# EasyEDA schematic schematic.easyeda.json
TITLE: SuperSensor; REV: 3.0; Date: 2025-11-12; Sheet: 1/1; Drawn By: Joshua M. Boniface; Company: Boniface Labs
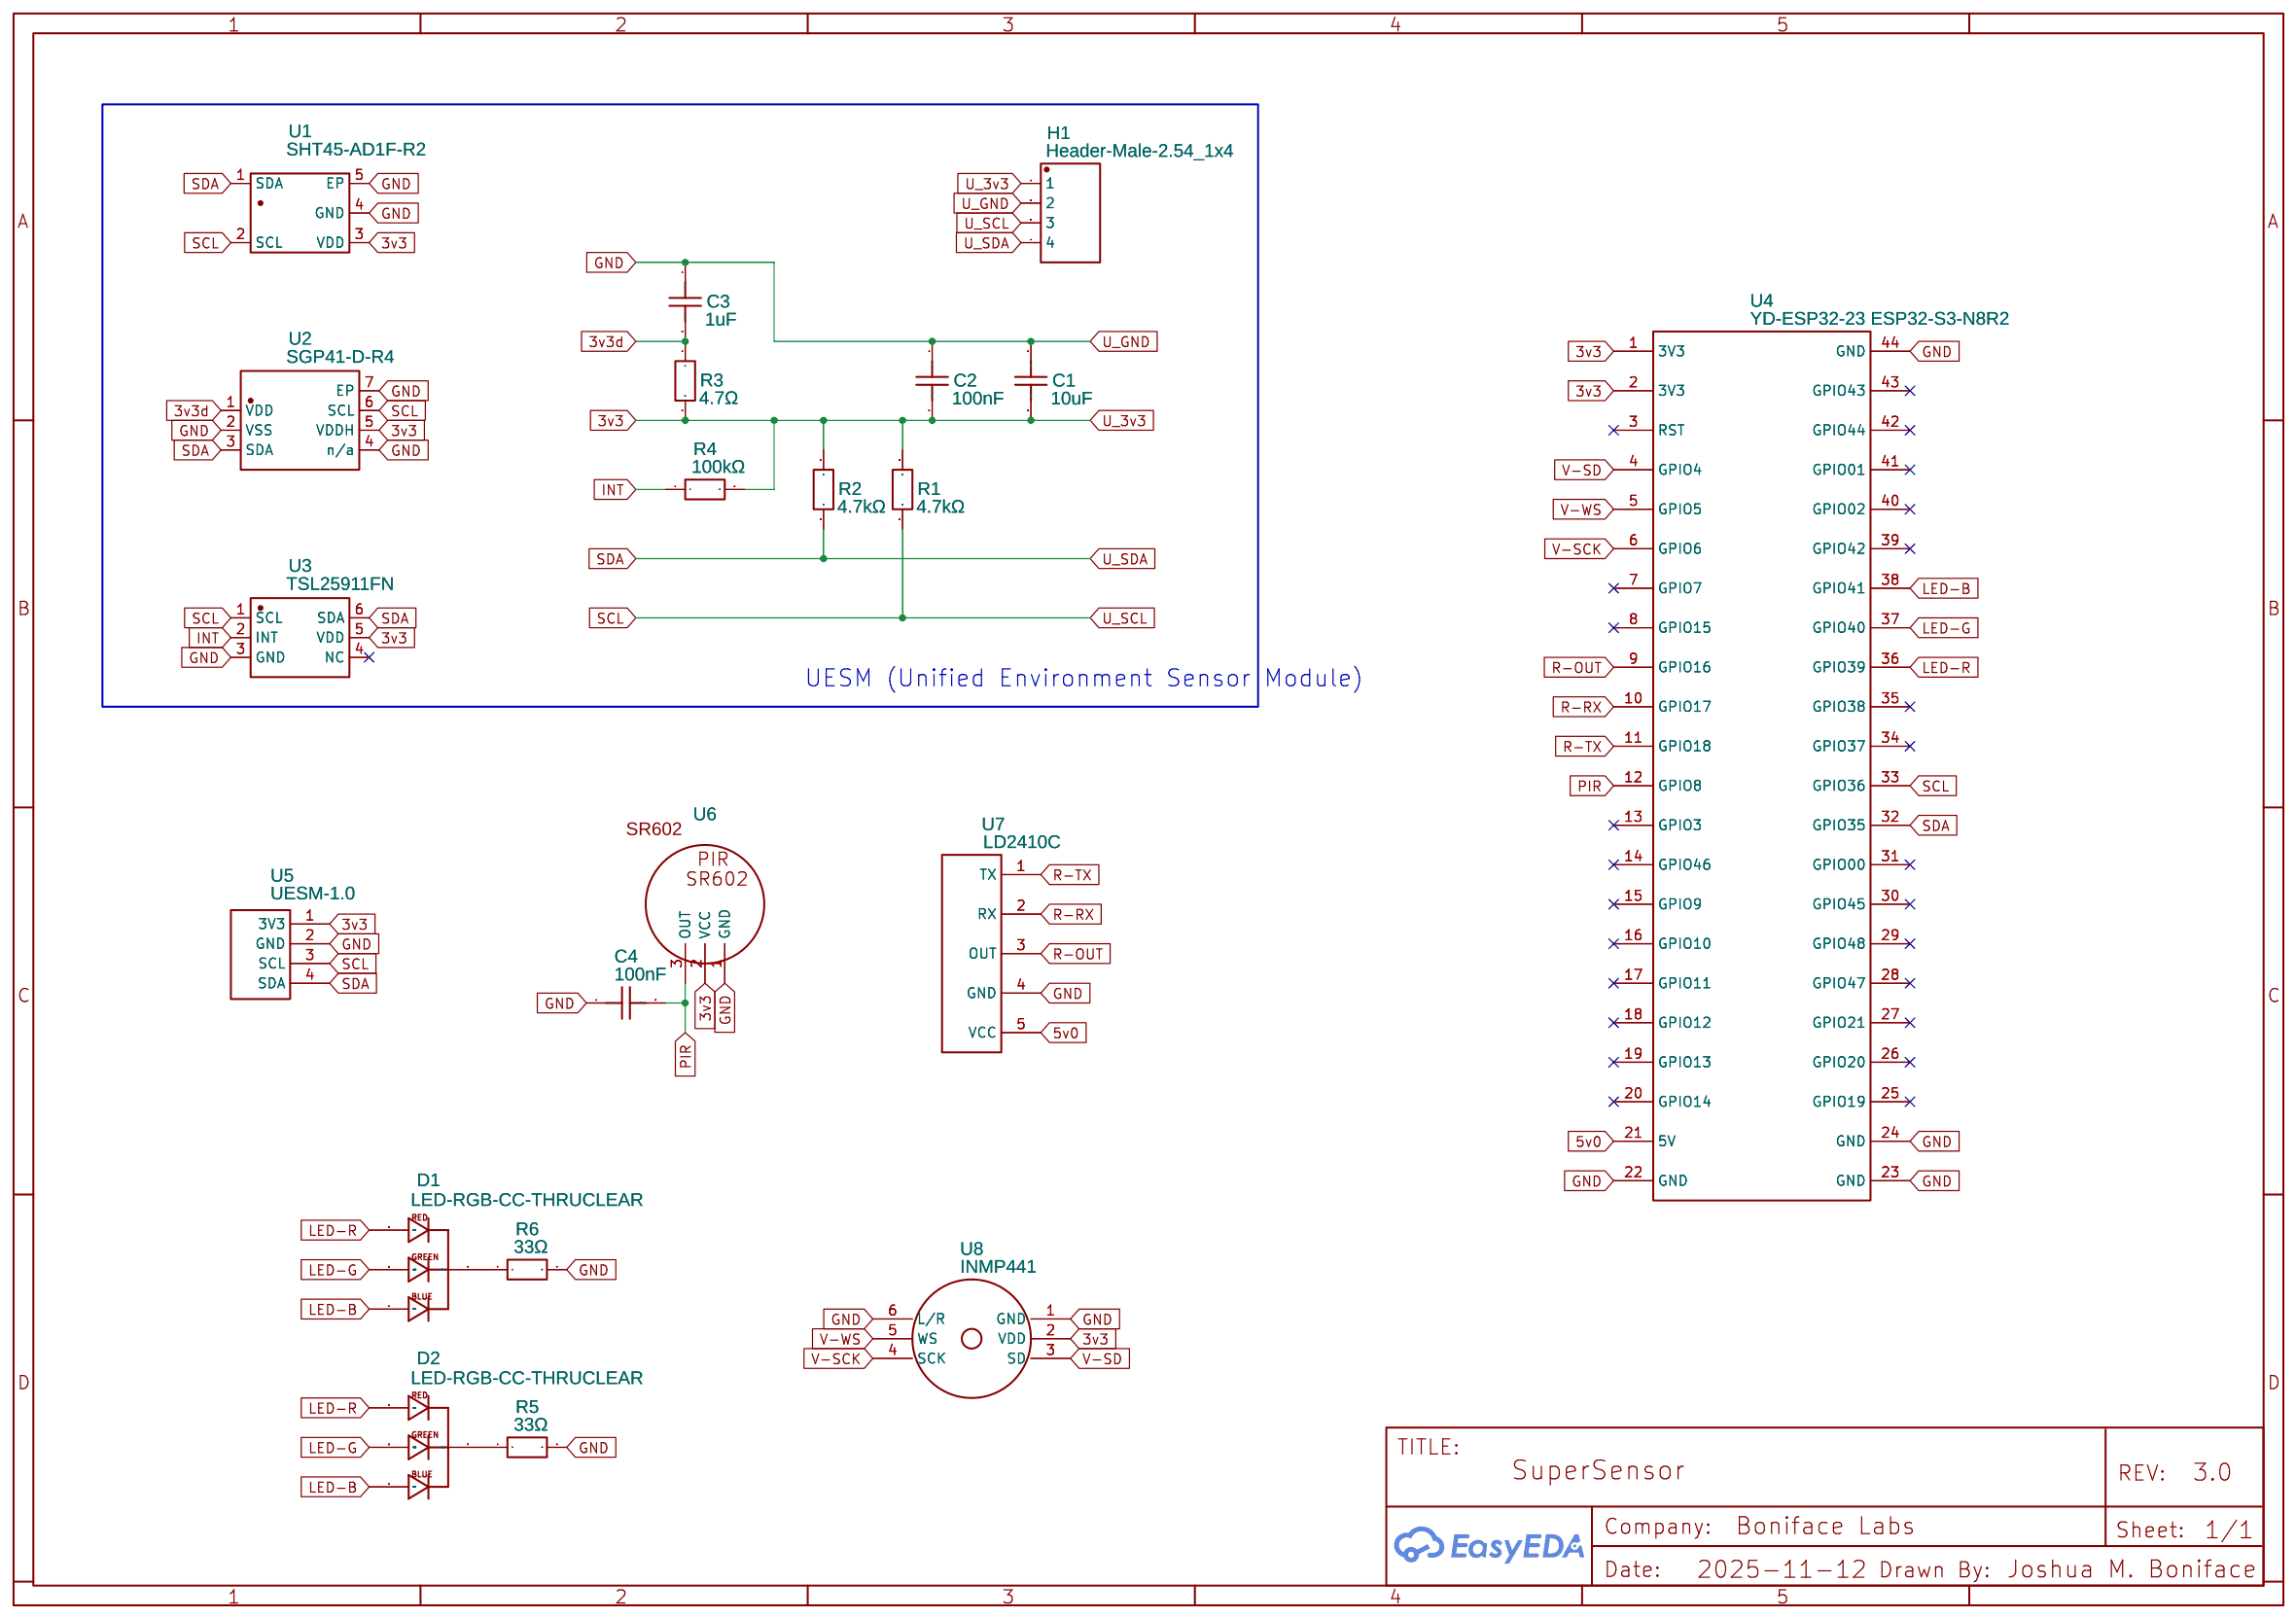
[diagram p0: schematic sheet]

## Parts
C1  10uF  [C0805]
C2  100nF  [C0805]
C3  1uF  [C0805]
C4  100nF  [C0805]
D1  LED-RGB-CC-THRUCLEAR  [LED-RGB-THRU]
D2  LED-RGB-CC-THRUCLEAR  [LED-RGB-THRU]
H1  Header-Male-2.54_1x4  [HDR-TH_4P-P2.54-V-M]
R1  4.7kΩ  [R1206]
R2  4.7kΩ  [R1206]
R3  4.7Ω  [R1206]
R4  100kΩ  [R0603]
R5  33Ω  [R1206]
R6  33Ω  [R1206]
U1  SHT45-AD1F-R2  [DFN-4_L1.5-W1.5-P0.8-TL-EP]
U2  SGP41-D-R4  [DFN-6_L2.4-W2.4-P0.80-TL-EP]
U3  TSL25911FN  [DFN-6_L2.4-W2.0-P0.65-BL]
U4  YD-ESP32-23 ESP32-S3-N8R2  [YD-ESP32-23 V1.3 ESP32-S3 REAL SIZE]
U5  UESM-1.0  [UESM-1.0]
U6  PIRSR602  [SR602_JB]
U7  LD2410C  [HLK-LD2410C_JB]
U8  INMP441  [INMP441-MEMS-I2S-MIC-MODULE_JB]

## Library data of the parts
C1 = C2012JB1C106K125AB: Contributor: lcsc; Supplier: LCSC; Supplier Part: C3905660; Manufacturer: TDK; JLCPCB Part Class: Extended Part
C2 C4 = C2012JB2A104K125AA: Contributor: lcsc; Supplier: LCSC; Supplier Part: C3875091; Manufacturer: TDK; JLCPCB Part Class: Extended Part
C3 = C2012X5R1E105K085AC: Contributor: lcsc; Supplier: LCSC; Supplier Part: C3905748; Manufacturer: TDK; JLCPCB Part Class: Extended Part
D1 D2 = LED-RGB-CC-THRUCLEAR: RGB Through-hole common cathode LED; Contributor: SparkFun
H1 = Header-Male-2.54_1x4: Contributor: LCSC; Supplier: LCSC; Manufacturer: Ckmtw(灿科盟); Manufacturer Part: B-2100S04P-A110; Supplier Part: C124378; JLCPCB Part Class: Extended Part
R1-R3 R5 R6 = CRGP1206F4K7: Supplier: LCSC; Supplier Part: C2074453; Manufacturer: TE Connectivity(泰科电子); JLCPCB Part Class: Extended Part; Contributor: lcsc
R4 = WF06H1003BTL: Supplier: LCSC; Supplier Part: C6025378; Manufacturer: Walsin(华新科); JLCPCB Part Class: Extended Part; Contributor: lcsc
U1 = SHT45-AD1F-R2: Supplier: LCSC; Supplier Part: C5360602; Manufacturer: Sensirion(瑞士盛思锐); JLCPCB Part Class: Extended Part; Contributor: lcsc
U2 = SGP41-D-R4: Contributor: lcsc; Supplier: LCSC; Supplier Part: C3659325; Manufacturer: Sensirion(瑞士盛思锐); JLCPCB Part Class: Extended Part
U3 = TSL25911FN: Contributor: lcsc; Supplier: LCSC; Supplier Part: C176812; Manufacturer: ams(艾迈斯半导体); JLCPCB Part Class: Extended Part
U4 = YD-ESP32-23 ESP32-S3-N16R8 REALSIZE AHRS: Contributor: raskatheli
U5 = UESM-1.0: Supplier: AliExpress; Contributor: mengrie
U6 = PIRSR602: Contributor: Vishal Autade
U7 = HLK-LD2410C WITH PCB: Supplier: AliExpress; Contributor: rockclimber
U8 = INMP441-MEMS-I2S-MIC-MODULE: Supplier: ebay; link: https://www.ebay.de/itm/174127178542; Contributor: cun280

## Nets
3v3: C1.2 C2.2 H1.1 R1.1 R2.1 R3.2 R4.2 U1.3(VDD) U2.5(VDDH) U3.5(VDD) U4.1(3V3) U4.2(3V3) U5.1(3V3) U6.2(VCC) U8.2(VDD)
3v3d: C3.2 R3.1 U2.1(VDD)
5v0: U4.21(5V) U7.5(VCC)
GND: C1.1 C2.1 C3.1 C4.1 H1.2 R5.2 R6.2 U1.4(GND) U1.5(EP) U2.2(VSS) U2.4(n/a) U2.7(EP) U3.3(GND) U4.22(GND) U4.23(GND) U4.24(GND) U4.44(GND) U5.2(GND) U6.1(GND) U7.4(GND) U8.1(GND) U8.6(L/R)
INT: R4.1 U3.2(INT)
LED-B: D1.4(BLUE_CATHODE) D2.4(BLUE_CATHODE) U4.38(GPIO41)
LED-G: D1.3(GREEN_CATHODE) D2.3(GREEN_CATHODE) U4.37(GPIO40)
LED-R: D1.1(RED_CATHODE) D2.1(RED_CATHODE) U4.36(GPIO39)
PIR: C4.2 U4.12(GPIO8) U6.3(OUT)
R-OUT: U4.9(GPIO16) U7.3(OUT)
R-RX: U4.10(GPIO17) U7.2(RX)
R-TX: U4.11(GPIO18) U7.1(TX)
SCL: H1.3 R1.2 U1.2(SCL) U2.6(SCL) U3.1(SCL) U4.33(GPIO36) U5.3(SCL)
SDA: H1.4 R2.2 U1.1(SDA) U2.3(SDA) U3.6(SDA) U4.32(GPIO35) U5.4(SDA)
V-SCK: U4.6(GPIO6) U8.4(SCK)
V-SD: U4.4(GPIO4) U8.3(SD)
V-WS: U4.5(GPIO5) U8.5(WS)
Net-(D1-2): D1.2(CATHODE) R6.1
Net-(D2-2): D2.2(CATHODE) R5.1

Not connected (* = marked no-connect by the designer): U3 4(NC)*; U4 3(RST)* 7(GPIO7)* 8(GPIO15)* 13(GPIO3)* 14(GPIO46)* 15(GPIO9)* 16(GPIO10)* 17(GPIO11)* 18(GPIO12)* 19(GPIO13)* 20(GPIO14)* 25(GPIO19)* 26(GPIO20)* 27(GPIO21)* 28(GPIO47)* 29(GPIO48)* 30(GPIO45)* 31(GPIO00)* 34(GPIO37)* 35(GPIO38)* 39(GPIO42)* 40(GPIO02)* 41(GPIO01)* 42(GPIO44)* 43(GPIO43)*

## Notes on the sheet
- UESM (Unified Environment Sensor Module)
